# Altium project tafiti-obc.PrjPcb
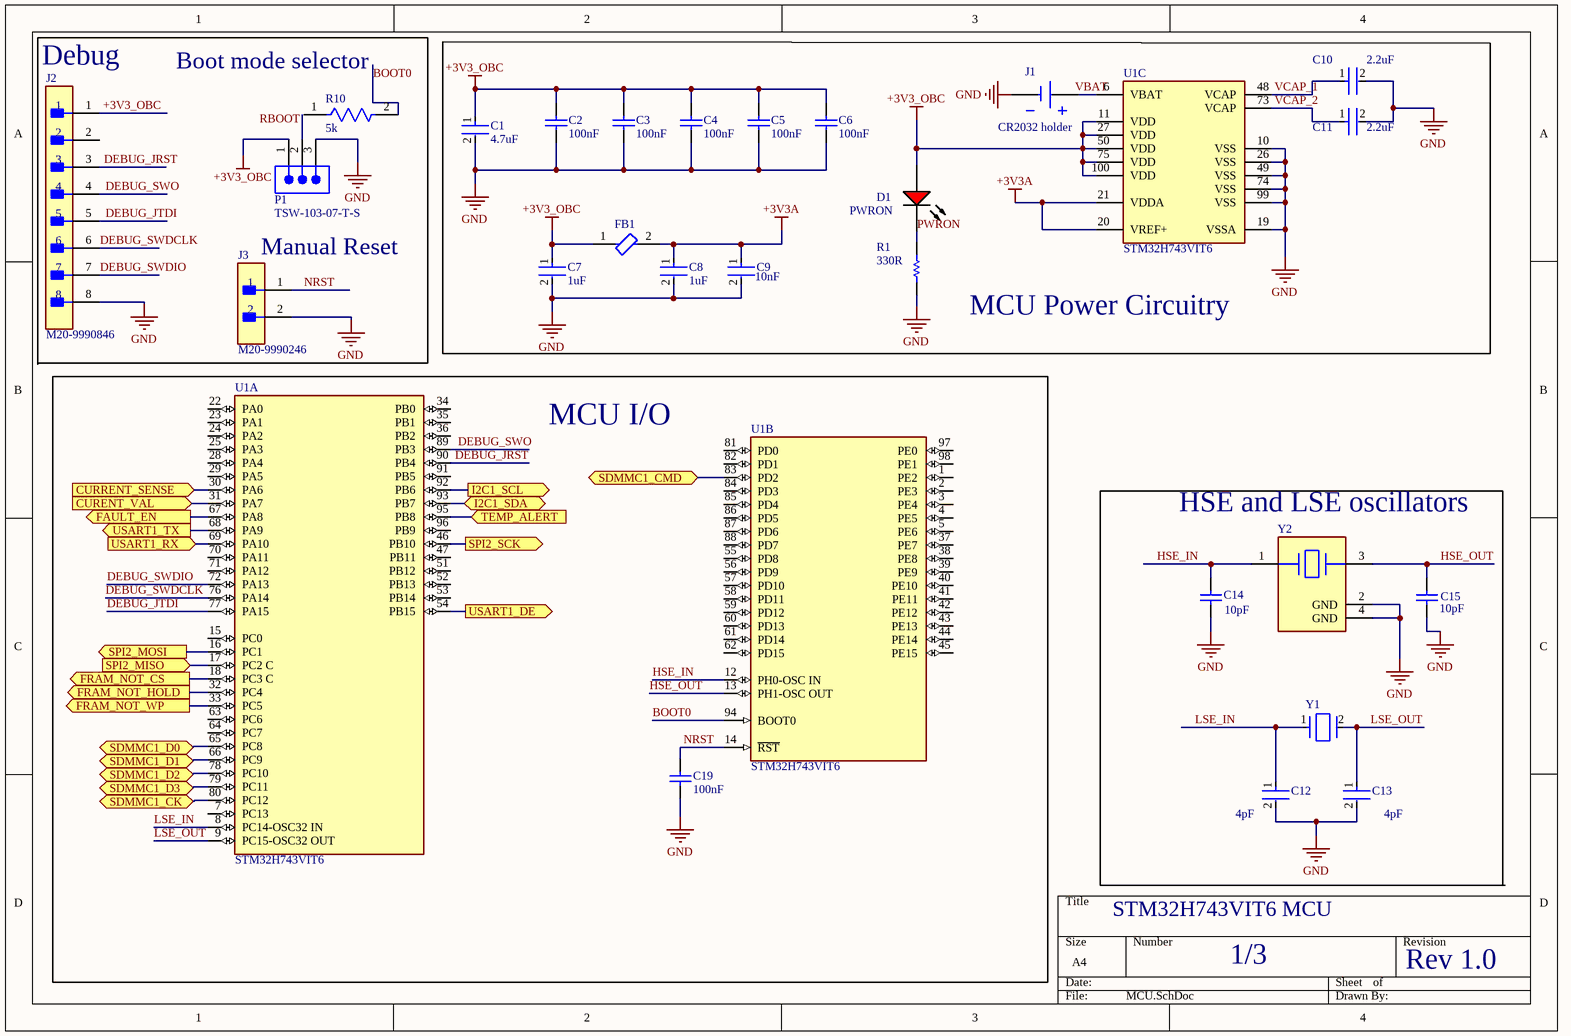
[diagram p0: MCU.SchDoc]
3 sheets, 57 parts. Net scope: flat (ports and power ports of the same name join across sheets).
Board file: tafiti-obc.PcbDoc
Sheets:
  MCU.SchDoc
  OTHER_PARTS.SchDoc
  CONNECTOR.SchDoc

## Sheet MCU.SchDoc
size A4; SheetNumber: 1; SheetTotal: 2

### Parts
C1  4.7uF  [FP-0805-L_2_0_0_1-W_1_25-IPC_B]
C2  100nF  [SAMS-C0603-2_M]
C3  100nF  [SAMS-C0603-2_M]
C4  100nF  [SAMS-C0603-2_M]
C5  100nF  [SAMS-C0603-2_M]
C6  100nF  [SAMS-C0603-2_M]
C7  1uF  [FP-CL10-IPC_C]
C8  1uF  [FP-CL10-IPC_C]
C9  10nF  [FP-CC0402-MFG]
C10  2.2uF  [FP-CC0805-0_85-MFG]
C11  2.2uF  [FP-CC0805-0_85-MFG]
C12  4pF  [FP-GRM033-0_03-IPC_B]
C13  4pF  [FP-GRM033-0_03-IPC_B]
C14  10pF  [CAPC1005X55X25ML05T05]
C15  10pF  [CAPC1005X55X25ML05T05]
C19  100nF  [SAMS-C0603-2_M]
D1  PWRON  [EVRL-0603-2_V]
FB1  MMZ1005D121CTD25  [FP-MMZ1005-IPC_C]  (value not drawn)
J1  CR2032 holder  [KEYSTONE-1025-7-2_V]
J2  M20-9990846  [FP-M20-9990846-MFG]
J3  M20-9990246  [FP-M20-9990246-MFG]
P1  TSW-103-07-T-S  [SMTC-TSW-103-07-X-S]
R1  330R  [RESC1608X55X25NL10T15]
R10  5k  [FP-MCR01-MFG]
U1  STM32H743VIT6  [FP-LQFP100-1L-MFG]  (parts A,B,C of 3)
Y1  ABS06-107-32.768KHZ-T  [FP-ABS06-MFG]  (value not drawn)
Y2  ABM3B-25.000MHZ-10-1-U-T  [FP-ABM3B-MFG]  (value not drawn)

### Blocks framed on the sheet
Debug: J2 J3 P1 R10
MCU Power Circuitry: C1-C11 D1 FB1 J1 R1 U1
MCU I/O: C19 U1
HSE and LSE oscillators: C12-C15 Y1 Y2

### Ports
CURENT_VAL (in), CURRENT_SENSE (in), FAULT_EN (out), FRAM_NOT_CS (out), FRAM_NOT_HOLD (out), FRAM_NOT_WP (out), I2C1_SCL (out), I2C1_SDA (bidir), SDMMC1_CK (bidir), SDMMC1_CMD (bidir), SDMMC1_D0 (bidir), SDMMC1_D1 (bidir), SDMMC1_D2 (bidir), SDMMC1_D3 (bidir), SPI2_MISO (in), SPI2_MOSI (out), SPI2_SCK (out), TEMP_ALERT (in), USART1_DE (out), USART1_RX (in), USART1_TX (out)

### Nets
+3V3_OBC: C1.1 C2.2 C3.2 C4.2 C5.2 C6.2 C7.1 D1.1(A) FB1.1 J2.1 P1.1 U1.11(VDD) U1.27(VDD) U1.50(VDD) U1.75(VDD) U1.100(VDD)
+3V3A: C8.1 C9.1 FB1.2 U1.20(VREF+) U1.21(VDDA)
GND: C1.2 C2.1 C3.1 C4.1 C5.1 C6.1 C7.2 C8.2 C9.2 C10.2 C11.2 C12.2 C13.2 C14.1 C15.1 C19.1 J1.2(-) J2.8 J3.2 P1.3 R1.1 U1.10(VSS) U1.19(VSSA) U1.26(VSS) U1.49(VSS) U1.74(VSS) U1.99(VSS) Y2.2(GND) Y2.4(GND)
BOOT0: R10.2 U1.94(BOOT0)
CURENT_VAL: U1.31(PA7) ; port CURENT_VAL
CURRENT_SENSE: U1.30(PA6) ; port CURRENT_SENSE
DEBUG_JRST: J2.3 U1.90(PB4)
DEBUG_JTDI: J2.5 U1.77(PA15)
DEBUG_SWDCLK: J2.6 U1.76(PA14)
DEBUG_SWDIO: J2.7 U1.72(PA13)
DEBUG_SWO: J2.4 U1.89(PB3)
FAULT_EN: U1.67(PA8) ; port FAULT_EN
FRAM_NOT_CS: U1.18(PC3_C) ; port FRAM_NOT_CS
FRAM_NOT_HOLD: U1.32(PC4) ; port FRAM_NOT_HOLD
FRAM_NOT_WP: U1.33(PC5) ; port FRAM_NOT_WP
HSE_IN: C14.2 U1.12(PH0-OSC_IN) Y2.1
HSE_OUT: C15.2 U1.13(PH1-OSC_OUT) Y2.3
I2C1_SCL: U1.92(PB6) ; port I2C1_SCL
I2C1_SDA: U1.93(PB7) ; port I2C1_SDA
LSE_IN: C12.1 U1.8(PC14-OSC32_IN) Y1.1
LSE_OUT: C13.1 U1.9(PC15-OSC32_OUT) Y1.2
NRST: C19.2 J3.1 U1.14(~{RST})
PWRON: D1.2(K) R1.2
SDMMC1_CK: U1.80(PC12) ; port SDMMC1_CK
SDMMC1_CMD: U1.83(PD2) ; port SDMMC1_CMD
SDMMC1_D0: U1.65(PC8) ; port SDMMC1_D0
SDMMC1_D1: U1.66(PC9) ; port SDMMC1_D1
SDMMC1_D2: U1.78(PC10) ; port SDMMC1_D2
SDMMC1_D3: U1.79(PC11) ; port SDMMC1_D3
SPI2_MISO: U1.17(PC2_C) ; port SPI2_MISO
SPI2_MOSI: U1.16(PC1) ; port SPI2_MOSI
SPI2_SCK: U1.46(PB10) ; port SPI2_SCK
TEMP_ALERT: U1.95(PB8) ; port TEMP_ALERT
USART1_DE: U1.54(PB15) ; port USART1_DE
USART1_RX: U1.69(PA10) ; port USART1_RX
USART1_TX: U1.68(PA9) ; port USART1_TX
VCAP_1: C10.1 U1.48(VCAP)
VCAP_2: C11.1 U1.73(VCAP)
NetJ1_1: J1.1(+) U1.6(VBAT)

Not connected (* = marked no-connect by the designer): J2 2; P1 2; R10 1; U1 1(PE2) 2(PE3) 3(PE4) 4(PE5) 5(PE6) 7(PC13) 15(PC0) 22(PA0) 23(PA1) 24(PA2) 25(PA3) 28(PA4) 29(PA5) 34(PB0) 35(PB1) 36(PB2) 37(PE7) 38(PE8) 39(PE9) 40(PE10) 41(PE11) 42(PE12) 43(PE13) 44(PE14) 45(PE15) 47(PB11) 51(PB12) 52(PB13) 53(PB14) 55(PD8) 56(PD9) 57(PD10) 58(PD11) 59(PD12) 60(PD13) 61(PD14) 62(PD15) 63(PC6) 64(PC7) 70(PA11) 71(PA12) 81(PD0) 82(PD1) 84(PD3) 85(PD4) 86(PD5) 87(PD6) 88(PD7) 91(PB5) 96(PB9) 97(PE0) 98(PE1)

### Notes on the sheet
- (near R10) Boot mode selector
- (near J3) Manual Reset
- STM32H743VIT6 MCU
- 1/3
- Rev 1.0
- Labels drawn without touching a wire or pin: RBOOT, VBAT

### Library data of the parts
C1 = CMP-14477-004784-2: Multilayer Ceramic Capacitor 4.7 uF 16V X7R 10% SMD 0805 T/R; Tolerance: 10%; Voltage Rating: 16V; Height: 1.25mm; Width: 0.049inch; Length: 2mm; Series: M; Case Code (Metric): 2012; Case Code (Imperial): 0805; Dielectric: X7R; Packaging: Tape and Reel; Case/Package: 0805; Capacitance: 4.7uF; Halogen Free: Halogen Free; RoHS Compliant: Yes; Package Quantity: 3000; Contact Plating: Tin; Max Operating Temperature: 125°C; Min Operating Temperature: -55°C; Resistor Type: Ceramic; Mount: Surface Mount; Voltage Rating (DC): 16V; Termination: SMD/SMT; Number of Pins: 2; Thickness: 0.053inch; Construction: Flat
C2-C6 C19 = CMP-2000-05332-1: Multi-layer Ceramic Capacitor, -55 to 125 degC, 2-Pin SMD (0603), RoHS, Tape and Reel; Manufacturer: Samsung Electro-Mechanics; Capacitance: 0.1µF; Rated Voltage: 50V; Dielectric: X7R; Tolerance (%): ±10%; Case Size/Dimension: 0603; Datasheet URL: https://datasheet.ciiva.com/29198/456651-da-01-en-vs-kondensator-0605-29198839.pdf; Manufacturer URL: http://www.samsungsem.com/global/index.jsp; Datasheet Version: Nov-10
C7 C8 = CMP-13271-004127-1: Cap Ceramic 1uF 25V X5R ±10% Pad SMD 0603 +85°C T/R; Height: 0.8mm; Capacitance: 1uF; Depth: 0.8mm; Package Quantity: 1; Mount: Surface Mount; Contact Plating: Tin; Voltage Rating: 25V; Dielectric: X5R; Packaging: Tape and Reel; Material: Ceramic; Case Code (Metric): 1608; Length: 1.6mm; Voltage: 25V; Min Operating Temperature: -55°C; Width: 0.031inch; Tolerance: 10%; Case/Package: 0603; Radiation Hardening: No; Case Code (Imperial): 0603; Thickness: 0.035inch; Lead Free: Lead Free; Max Operating Temperature: 85°C; Voltage Rating (DC): 25V
C9 = CMP-03422-000804-1: CAP CER 10000PF 10V X7R 0402; Manufacturer: YAGEO; Manufacturer Part Number: CC0402KRX7R6BB103; Automotive Grade: NA; Material: Ceramic; Tolerance: 0.1; Temperature Coefficient: 30ppm/°C; Temperature Characteristic: X7R; Digikey Description: CAP CER 10000PF 10V X7R 0402; Footprint Url: http://www.yageo.com/exep/pages/download/literatures/UPY-C_GEN_24.pdf; Category: Cap; RoHS: TRUE; Temperature Range Low: -55°C; Lead Free: Yes; ComponentLink2Description: Datasheet; Device Class L2: Capacitors; Temperature Range High: +125°C; Value: 10 nF; Ipc Land Pattern Name: CAPC10050X50; Temperature: -55°C to +125°C; ComponentLink2URL: http://www.yageo.com/documents/recent/UPY-GP_NP0_16V-to-50V_16.pdf; Device Class L3: Ceramic Capacitors; Capacitance: 10 nF; Package: CC0402; Height: 0.55mm; Automotive: No; Octopart: https://octopart.com/cc0402krx7r6bb103-yageo-26721868; Mouser Description: Multilayer Ceramic Capacitors MLCC - SMD/SMT 10nF 10V X7R 10%; Device Class L1: Passive Components; Voltage Rating: 10 V
C10 C11 = CMP-1036-04838-2: CAP CER 2.2UF 25V X7R 0805; Manufacturer Part Number: CC0805KKX7R8BB225; Manufacturer: Yageo; Material: Ceramic; Tolerance: 0.1; Device Class L1: Passive Components; Value: 2.2 uF; Temperature: -30°C to +85°C; Octopart: https://octopart.com/cc0805kkx7r8bb225-yageo-42522865; ComponentLink2Description: Datasheet; Capacitance: 2.2 uF; ComponentLink2URL: http://www.yageo.com/documents/recent/UPY-GPHC_Y5V_6.3V-to-50V_8.pdf; Mouser Description: Multilayer Ceramic Capacitors MLCC - SMD/SMT 2.2uF 25V X7R 10%; RoHS: TRUE; Temperature Range High: +85°C; Lead Free: Yes; Voltage Rating: 25 V; Height: 0.95mm; Category: Cap; Automotive: No; Digikey Description: CAP CER 2.2UF 25V X7R 0805; Temperature Characteristic: X7R; Ipc Land Pattern Name: CAPC200125X85; Device Class L2: Capacitors; Footprint Url: http://www.yageo.com/exep/pages/download/literatures/UPY-C_GEN_24.pdf; Package: CC0805-0.85; Device Class L3: Ceramic Capacitors; Temperature Range Low: -30°C
C12 C13 = CMP-2010-01389-2: Chip Multilayer Ceramic Capacitors for General Purpose, 0201, 4.0pF, C0G, 30ppm/°C, 0.25pF, 25V; Case Code (Imperial): 0201; Thickness: 0.013inch; Voltage Rating (DC): 25V; Termination: SMD/SMT; Dielectric: C0G; Length: 0.024inch; Height: 0.3mm; Width: 0.012inch; Min Operating Temperature: -55°C; Capacitance: 4pF; Case/Package: 0201; Voltage Rating: 25V; Case Code (Metric): 0603; Packaging: Tape and Reel; Max Operating Temperature: 125°C; Mount: Surface Mount; Package Quantity: 15000; Lead Free: Lead Free
C14 C15 = CMP-2100-03589-1: Chip Capacitor, 10 pF, +/- 5%, 50 V, -55 to 125 degC, 0402 (1005 Metric), RoHS, Tape and Reel; Manufacturer: Yageo; Insulation Resistance: 100GR; Voltage Rating (DC): 50V; Dielectric Material: Ceramic; Temperature Coefficient: 30ppm/degC; Dielectric: C0G; Termination: SMD/SMT; Package Reference: 0402; Lead Free: LeadFree; Composition: Ceramic; Tolerance: 5%; Case Code (Metric): 1005; Voltage Rating: 50V; Packaging: TapeandReel; Manufacturer URL: http://www.yageo.com/; REACH SVHC: NoSVHC; Max Operating Temperature: 125degC; Length: 1mm; Mount: SurfaceMount; Depth: 0.5mm; Min Operating Temperature: -55degC; Number of Pins: 2; Width: 0.02inch; Datasheet Version: Rev. 14, 07/2016; Package Quantity: 1; Datasheet URL: http://www.yageo.com/documents/recent/UPY-GP_NP0_16V-to-50V_14.pdf; Case Code (Imperial): 0402; RoHSCompliant: True; Radiation Hardening: No; Height: 0.5mm; Case/Package: 0402; Thickness: 0.022inch; Capacitance: 10pF; Package Description: 2-Pin Surface Mount Device, Body 1 x 0.5 mm; Voltage: 50V
D1 = CMP-2100-03578-1: Chip LED, Red, 5 V, 25 mA, -40 to 85 degC, 2-Pin SMD (0603), RoHS, Tape and Reel; Manufacturer: Everlight Electronics; Forward Voltage: 2.2V; Lens Style: Clear; Package Reference: 0603; Case/Package: 0603; RoHSCompliant: false; Package Description: 2-Pin Surface Mount Device, Body 1.6 x 0.8 mm; Colour: Red; Lead Free: LeadFree; Datasheet URL: https://datasheet.ciiva.com/4688/el-19-217-r6c-al1m2vy-3tpdf-187026-4688713.pdf; Manufacturer URL: http://www.everlight.com/; Datasheet Version: Rev. 1, 01/2005
FB1 = CMP-08257-000320-1: Signal Line Ferrite Bead 120Ω @ 100MHz 350mA DCR 600mΩ AEC-Q200 SMD 0402; DC Resistance-Max: 600mR; Impedance: 120R; Number of Lines: 1; Max Current Rating: 350mA; Mount: Surface Mount; Case Code (Imperial): 0402; Case Code (Metric): 1005; Lead Free: Lead Free; Series: MMZ; Min Operating Temperature: -55°C; DC Resistance (DCR): 600mR; Height: 0.022inch; Case/Package: 0402; Current Rating: 350mA; Ratings: AEC-Q200; Packaging: Tape and Reel; Max Operating Temperature: 125°C; RoHS Compliant: Yes; Length: 0.039inch; Width: 0.02inch; Package Quantity: 10000
J1 = CMP-0465-00001-2: Holder for 2477 or 2430 Cells P/N 1025-7, Body 27.762 x 30.963 mm, THM; Manufacturer: Keystone; # of Cells: 1; Cell Size: 24 mm; ComponentLink1Description: Manufacturer URL; PackageDescription: 2-Pin Hand Drawn, Body 27.762 x 30.963 mm; Material: Plastic; ComponentLink1URL: http://www.keyelco.com/; Type: HOLDER; ComponentLink2URL: http://www.keyelco.com/product-pdf.cfm?p=3950; Switch Current Limit (Typ) (A): 1; PartNumber: 1025-7; ComponentLink2Description: Datasheet; PackageReference: KEYSTONE-1025-7-2; DatasheetVersion: Rev.C; Mounting Technology: Through Hole
J2 = CMP-15831-000033-1: CONN HEADER VERT 8POS 2.54MM; Connector Type: Male Pin; Gender: Male; Insulation Resistance: 1GR; Number of Positions: 8; Contact Resistance: 30mR; Current Rating: 3A; Termination: Solder; Case/Package: SIL; RoHS Compliant: Yes; Series: M20; Housing Material: Nylon; Radiation Hardening: No; Package Quantity: 1000; Contact Material: Brass; Contact Plating: Tin; Max Operating Temperature: 105°C; Contact Mating Length: 0.24inch; Depth: 2.54mm; Color: Black; Number of Contacts: 8; Mount: Through Hole; Number of Rows: 1; Packaging: Bulk; Min Operating Temperature: -40°C; Max Current Rating: 3A; REACH SVHC: No SVHC; Pitch: 2.54mm; Housing Color: Black; Orientation: Straight; Length: 20.32mm; Contact Type: Male Pin
J3 = CMP-15831-000009-1: CONN HEADER VERT 2POS 2.54MM; Manufacturer: Harwin; Conn Gender: Male; Conn Orientation: Vertical; Number Of Contacts: 2; Current Rating: 3A; ComponentLink2URL: https://cdn.harwin.com/pdfs/M20-999.pdf; ComponentLink2Description: Datasheet; Package: M20-9990246; Temperature: -40°C to +105°C; Octopart: https://octopart.com/m20-9990246-harwin-2590635; Mouser Description: 2.54mm (0.1") Pitch SIL Vertical PC Tail Pin Header, 6.1mm mating pin height, tin, 2 contacts; Temperature Range High: +105°C; Device Class L1: Connectors; RoHS: TRUE; Automotive: No; Height: 8.99mm; Number Of Rows: 1; Contact Material: Tin,Nickel; Category: Conn; Pitch: 2.54mm; Lead Free: Yes; Digikey Description: CONN HEADER VERT 2POS 2.54MM; Manufacturer Part Number: M20-9990246; Temperature Range Low: -40°C; Device Class L3: unset; Device Class L2: Headers and Wire Housings
P1 = CMP-1024-00332-1: 0.025" SQ Post Header, Through-hole, Vertical, -55 to 105 degC, 2.54 mm Pitch, 3-Pin, Male, RoHS; Manufacturer: Samtec; Pitch: 2.54 mm; ComponentLink1URL: http://www.samtec.com; ComponentLink3URL: http://www.samtec.com/documents/webfiles/cpdf/TSW-XXX-XX-XXX-X-XX-XXX-MKT.pdf; PartNumber: TSW-103-07-T-S; Mounting Technology: Through-hole; RoHS: True; DatasheetVersion: F-214; PackageVersion: DM, 8/1988; Temperature Range: -55 to 105 degC; ComponentLink2Description: Datasheet; ComponentLink1Description: Manufacturer URL; Orientation: Vertical; PackageReference: TSW-103-07-X-S; ComponentLink3Description: Package Specification; ComponentLink2URL: http://www.samtec.com/documents/webfiles/pdf/TSW_TH.PDF; PackageDescription: .025[0.64] SQ. Post Terminal Strip Assembly
R1 = CMP-1659-00020-2: Chip Resistor, 330 Ohm, +/- 1%, 0.1 W, -55 to 155 degC, 0603 (1608 Metric), RoHS, Tape and Reel; Tolerance: 10%; ESR: 800 mohm; Voltage Rating (DC): 16 V; Capacitance: 47 uF; Length: 7.3 mm; ComponentLink1URL: http://www.yageo.com/; Packaging: Tape and Reel; Pins: 2; ComponentLink1Description: Manufacturer URL; Case Code (Imperial): 2917; REACH SVHC: No SVHC; Width: 4.3 mm; ComponentLink2Description: Datasheet; Voltage Rating: 16 V; RoHSCompliant: True; Max Operating Temperature: 125degC; ComponentLink2URL: http://www.yageo.com/documents/recent/PYu-RC_Group_51_RoHS_L_04.pdf; Min Operating Temperature: -55degC; Case/Package: 2917; Radiation Hardening: No; DatasheetVersion: Rev. 4, 02/2016; Mount: Surface Mount; PackageReference: 0603; Package Quantity: 500; Case Code (Metric): 7343; PackageDescription: 2-Pin Surface Mount Device, Body 1.6 x 0.8 mm; Height: 3.1 mm
R10 = CMP-08839-006175-1: Thick Film Chip Resistor, 0402, 5.1kΩ, 1%, 100ppm/°C, 0.063W, 50V; Max Power Dissipation: 63mW; Resistance: 5.1kR; Temperature Coefficient: 400ppm/°C; Package Quantity: 10000; Length: 0.039inch; Number of Terminations: 2; Depth: 0.5mm; Case Code (Metric): 1005; Resistor Type: Thick Film; Series: MCR01; Width: 0.02inch; Construction: Rectangular; Case Code (Imperial): 0402; Case/Package: 0402; Voltage Rating (DC): 50V; Lead Free: Lead Free; RoHS Compliant: Yes; Packaging: Tape and Reel; Military Standard: Not; Height: 0.016inch; Max Operating Temperature: 155°C; Min Operating Temperature: -55°C; Tolerance: 1%; Features: Automotive AEC-Q200
U1 = CMP-12105-000050-1: IC MCU 32BIT 2MB FLASH 100LQFP; Manufacturer: STMicroelectronics; Number Of Ethernet Channels: 1; Number Of Usb Channels: 2; Number Of A/D Converters: 3; Min Supply Voltage: 1.71V; Ram Size: 1060KBytes; Number Of I2C Channels: 4; Frequency: 480MHz; Number Of Adc Channels: 36; Number Of I/Os: 82; Max Supply Voltage: 3.6V; Number Of Spi Channels: 6; Memory Size: 2MBytes; Max Junction Temp: +125°C; Core Architecture: Arm Cortex-M7; Interface: I2C,SPI,UART,USART,USB,LIN,IrDA,Ethernet,I2S,Other; Number Of Timers/Counters: 20; Data Bus Width: 32bits; Number Of Pwm Channels: 42; Number Of Uart Channels: 9; Standoff Height: 0.05mm; Device Class L1: Integrated Circuits (ICs); ComponentLink2URL: https://www.st.com/resource/en/datasheet/stm32h743vi.pdf; Automotive: No; Memory Type: FLASH; Number Of Cores: 1; Temperature Range Low: -40°C; RoHS: TRUE; Ambient Temperature Range Low: -40°C; ComponentLink2Description: Datasheet; Device Class L2: Embedded Processors and Controllers; Device Class L3: Microcontrollers; Digikey Description: IC MCU 32BIT 2MB FLASH 100LQFP; Temperature Range High: +125°C; Ambient Temperature Range High: +85°C; Package: LQFP100-1L; Temperature: -40°C to +125°C; Category: IC; Ipc Land Pattern Name: QFP50P1600X1600X160-100; Height: 1.6mm; Manufacturer Part Number: STM32H743VIT6; Octopart: https://octopart.com/stm32h743vit6-stmicroelectronics-76372527; Lead Free: Yes
Y1 = CMP-2000-05734-2: CRYSTAL 32.7680KHZ 4PF SMD; Frequency Tolerance: 20ppm; Series Resistance: 80kR; ESR (Equivalent Series Resistance): 60kR; Frequency Stability: 175ppm; Height: 0.024inch; Termination: SMD/SMT; Package Quantity: 3000; Frequency: 32.768kHz; RoHS Compliant: Yes; Max Operating Temperature: 85°C; Length: 0.079inch; Radiation Hardening: No; Case/Package: 0805; Tolerance: 20ppm; REACH SVHC: No SVHC; Case Code (Imperial): 0805; Width: 0.047inch; Min Operating Temperature: -40°C; Case Code (Metric): 2012; Load Capacitance: 4pF; Mount: Surface Mount; Packaging: Tape and Reel; Lead Free: Lead Free; Number of Pins: 2
Y2 = CMP-27762-002145-1: Crystal 25MHz ±10ppm 10pF SMD-4 5mm x 3.2mm; ESR (Equivalent Series Resistance): 50R; Package Quantity: 1000; Min Operating Temperature: -10°C; Resistor Type: Ceramic; Series: ABM3B; Packaging: Tape and Reel; Case/Package: CSMD; Length: 5mm; Mount: Surface Mount; Tolerance: 10ppm; Height: 0.043inch; Width: 3.2mm; Load Capacitance: 10pF; Frequency: 25MHz; Lead Free: Lead Free; Radiation Hardening: No; Max Operating Temperature: 60°C; Termination: SMD/SMT; Frequency Stability: 10ppm; Number of Pins: 4; RoHS Compliant: Yes; Operating Frequency: 25 MHz; Frequency Tolerance: 10ppm; Depth: 3.2mm; REACH SVHC: No SVHC

## Sheet OTHER_PARTS.SchDoc
size A4; SheetNumber: 2; SheetTotal: 2
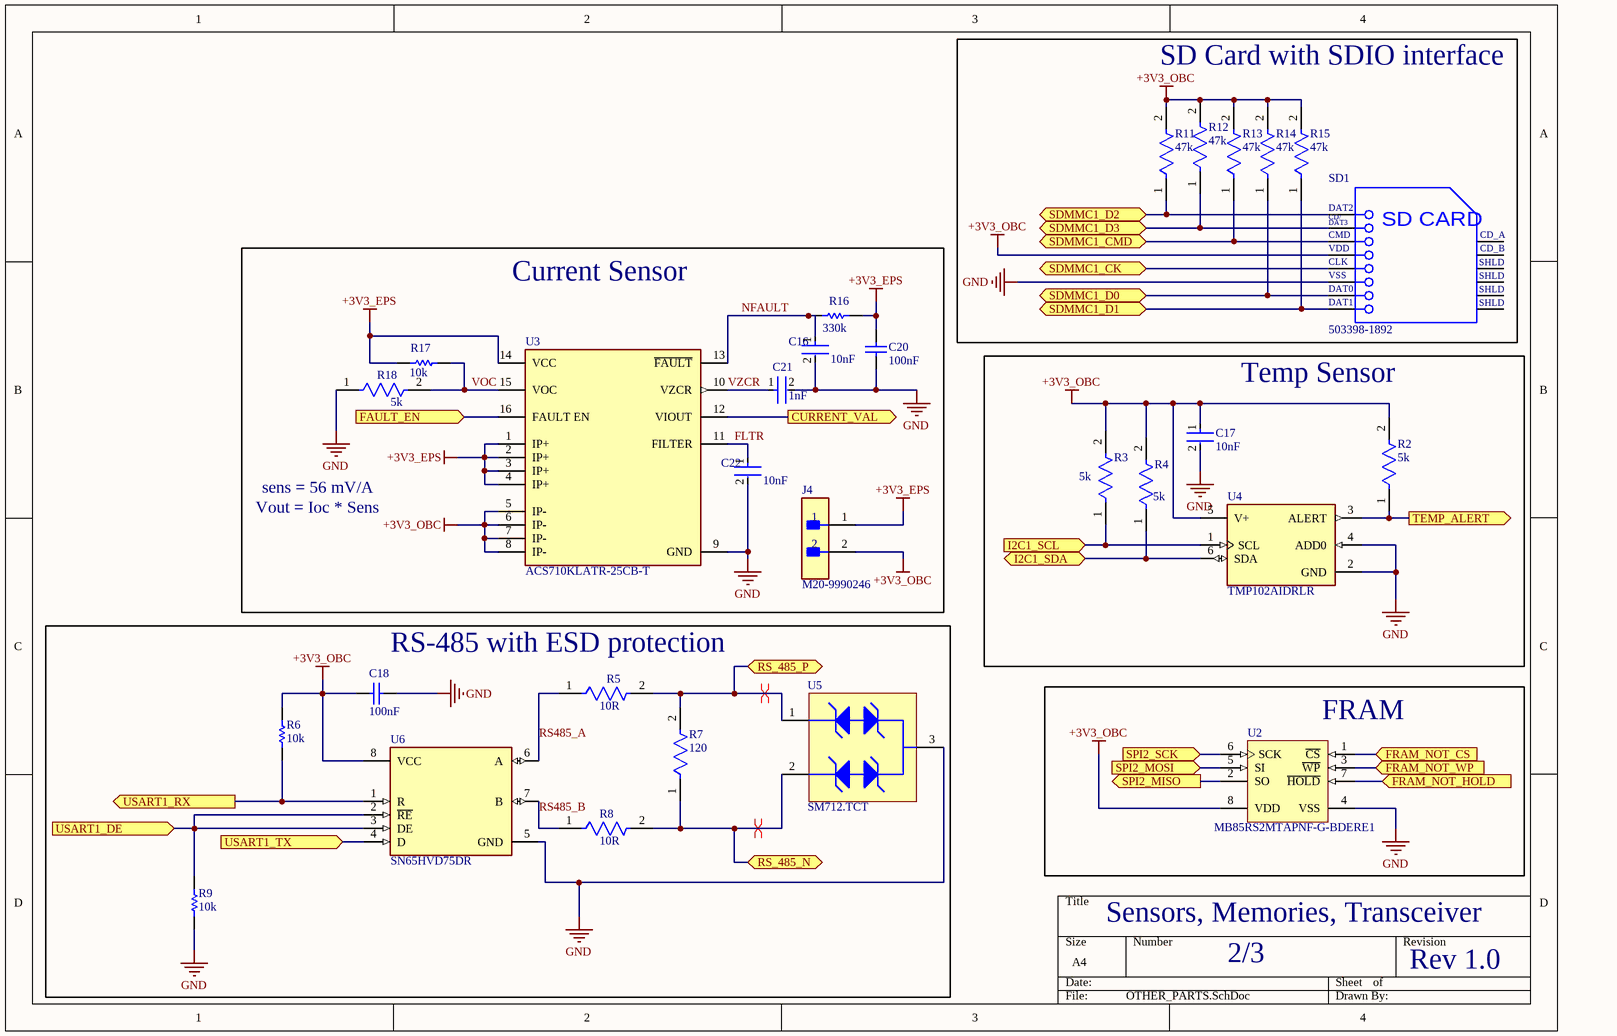
[diagram p1: OTHER_PARTS.SchDoc]

### Parts
C16  10nF  [FP-CL165-IPC_C]
C17  10nF  [FP-CL165-IPC_C]
C18  100nF  [SAMS-C0603-2_M]
C20  100nF  [SAMS-C0603-2_M]
C21  1nF  [FP-CC0402-MFG]
C22  10nF  [FP-CL165-IPC_C]
J4  M20-9990246  [FP-M20-9990246-MFG]
R2  5k  [FP-MCR01-MFG]
R3  5k  [FP-MCR01-MFG]
R4  5k  [FP-MCR01-MFG]
R5  10R  [FP-SR0805-MFG]
R6  10k  [RESC1608X55X25ML10T15]
R7  120  [FP-AC1206-MFG]
R8  10R  [FP-SR0805-MFG]
R9  10k  [RESC1608X55X25ML10T15]
R11  47k  [FP-MCR01-IPC_C]
R12  47k  [FP-MCR01-IPC_C]
R13  47k  [FP-MCR01-IPC_C]
R14  47k  [FP-MCR01-IPC_C]
R15  47k  [FP-MCR01-IPC_C]
R16  330k  [RESC1005X40X25ML05T10]
R17  10k  [RESC1608X55X25ML10T15]
R18  5k  [FP-MCR01-MFG]
SD1  503398-1892  [MOLX-503398-1892_V]
U2  MB85RS2MTAPNF-G-BDERE1  [CYP-S08.15_M]
U3  ACS710KLATR-25CB-T  [FP-LA-16-IPC_C]
U4  TMP102AIDRLR  [FP-DRL0006A-MFG]
U5  SM712.TCT  [SMTC-SOT23-3_V]
U6  SN65HVD75DR  [FP-D0008A-MFG]

### Blocks framed on the sheet
SD Card with SDIO interface: R11-R15 SD1
Current Sensor: C16 C20-C22 J4 R16-R18 U3
Temp Sensor: C17 R2-R4 U4
RS-485 with ESD protection: C18 R5-R9 U5 U6
FRAM: U2

### Ports
CURRENT_VAL (out), FAULT_EN (in), FRAM_NOT_CS (in), FRAM_NOT_HOLD (in), FRAM_NOT_WP (in), I2C1_SCL (in), I2C1_SDA (bidir), RS_485_N (bidir), RS_485_P (bidir), SDMMC1_CK (bidir), SDMMC1_CMD (bidir), SDMMC1_D0 (bidir), SDMMC1_D1 (bidir), SDMMC1_D2 (bidir), SDMMC1_D3 (bidir), SPI2_MISO (out), SPI2_MOSI (in), SPI2_SCK (in), TEMP_ALERT (out), USART1_DE (in), USART1_RX (out), USART1_TX (in)

### Nets
+3V3_EPS: C20.2 J4.1 R16.2 R17.2 U3.1(IP+) U3.2(IP+) U3.3(IP+) U3.4(IP+) U3.14(VCC)
+3V3_OBC: C17.1 C18.1 J4.2 R2.2 R3.2 R4.2 R6.2 R11.2 R12.2 R13.2 R14.2 R15.2 SD1.4(VDD) U2.8(VDD) U3.5(IP-) U3.6(IP-) U3.7(IP-) U3.8(IP-) U4.5(V+) U6.8(VCC)
GND: C16.2 C17.2 C18.2 C20.1 C21.2 C22.2 R9.1 R18.1 SD1.6(VSS) U2.4(VSS) U3.9(GND) U4.2(GND) U4.4(ADD0) U5.3 U6.5(GND)
CURRENT_VAL: U3.12(VIOUT) ; port CURRENT_VAL
FAULT_EN: U3.16(FAULT_EN) ; port FAULT_EN
FLTR: C22.1 U3.11(FILTER)
FRAM_NOT_CS: U2.1(~{CS}) ; port FRAM_NOT_CS
FRAM_NOT_HOLD: U2.7(~{HOLD}) ; port FRAM_NOT_HOLD
FRAM_NOT_WP: U2.3(~{WP}) ; port FRAM_NOT_WP
I2C1_SCL: R3.1 U4.1(SCL) ; port I2C1_SCL
I2C1_SDA: R4.1 U4.6(SDA) ; port I2C1_SDA
NFAULT: C16.1 R16.1 U3.13(~{FAULT})
RS485_A: R5.1 U6.6(A)
RS485_B: R8.1 U6.7(B)
RS_485_N: R7.1 R8.2 U5.2 ; port RS_485_N
RS_485_P: R5.2 R7.2 U5.1 ; port RS_485_P
SDMMC1_CK: SD1.5(CLK) ; port SDMMC1_CK
SDMMC1_CMD: R13.1 SD1.3(CMD) ; port SDMMC1_CMD
SDMMC1_D0: R14.1 SD1.7(DAT0) ; port SDMMC1_D0
SDMMC1_D1: R15.1 SD1.8(DAT1) ; port SDMMC1_D1
SDMMC1_D2: R11.1 SD1.1(DAT2) ; port SDMMC1_D2
SDMMC1_D3: R12.1 SD1.2(CD/DAT3) ; port SDMMC1_D3
SPI2_MISO: U2.2(SO) ; port SPI2_MISO
SPI2_MOSI: U2.5(SI) ; port SPI2_MOSI
SPI2_SCK: U2.6(SCK) ; port SPI2_SCK
TEMP_ALERT: R2.1 U4.3(ALERT) ; port TEMP_ALERT
USART1_DE: R9.2 U6.2(~{RE}) U6.3(DE) ; port USART1_DE
USART1_RX: R6.1 U6.1(R) ; port USART1_RX
USART1_TX: U6.4(D) ; port USART1_TX
VOC: R17.1 R18.2 U3.15(VOC)
VZCR: C21.1 U3.10(VZCR)

Not connected (* = marked no-connect by the designer): SD1 9(CD_A) 10(CD_B) 11(SHLD) 12(SHLD) 13(SHLD) 14(SHLD)

### Layout directives
differential pair: RS_485_N, RS_485_P

### Notes on the sheet
- Vout = Ioc * Sens
- sens = 56 mV/A
- Sensors, Memories, Transceiver
- 2/3
- Rev 1.0
- (in symbol CMP-2000-05621-1) CD/; DAT3; SD CARD

### Library data of the parts
C16 C17 C22 = CMP-13271-000387-1: Cap Ceramic 10nF 50V X7R ±10% SMD 0402 +125°C Paper T/R; Depth: 0.5mm; Length: 1mm; Lead Free: Lead Free; Case Code (Metric): 1005; Width: 0.02inch; Min Operating Temperature: -55°C; Thickness: 0.022inch; Package Quantity: 1; Mount: Surface Mount; Height: 0.5mm; Voltage: 50V; Material: Ceramic; Tolerance: 10%; Case Code (Imperial): 0402; Radiation Hardening: No; Case/Package: 0402; Max Operating Temperature: 125°C; Voltage Rating (DC): 50V; Contact Plating: Tin; Packaging: Tape and Reel; Voltage Rating: 50V; Capacitance: 10nF; Dielectric: X7R
C18 C20 = CMP-2000-05332-1: as C2 on sheet MCU; Case Size/Dimension: 0603; Datasheet URL: https://datasheet.ciiva.com/29198/456651-da-01-en-vs-kondensator-0605-29198839.pdf; Manufacturer URL: http://www.samsungsem.com/global/index.jsp; Datasheet Version: Nov-10
C21 = CMP-2002-03059-2: CAP CER 1000PF 50V X7R 0402; Manufacturer: YAGEO; Manufacturer Part Number: CC0402KRX7R9BB102; Value: 1.0 nF; Automotive Grade: NA; Tolerance: 0.1; Material: Ceramic; Temperature Coefficient: 30ppm/°C; Temperature Range High: +125°C; Device Class L3: Ceramic Capacitors; ComponentLink2Description: Datasheet; Footprint Url: http://www.yageo.com/exep/pages/download/literatures/UPY-C_GEN_24.pdf; ComponentLink2URL: http://www.yageo.com/documents/recent/UPY-GP_NP0_16V-to-50V_16.pdf; Mouser Description: 0402 1000 pF 50 V ±10 % Tolerance X7R SMT Multilayer Ceramic Capacitor; Ipc Land Pattern Name: CAPC10050X50; Temperature Range Low: -55°C; Digikey Description: CAP CER 1000PF 50V X7R 0402; Temperature Characteristic: X7R; Voltage Rating: 50 V; Lead Free: Yes; Device Class L1: Passive Components; Height: 0.55mm; Capacitance: 1.0 nF; Category: Cap; Device Class L2: Capacitors; Temperature: -55°C to +125°C; Package: CC0402; Octopart: https://octopart.com/cc0402krx7r9bb102-yageo-192889; Automotive: No; RoHS: TRUE
J4 = CMP-15831-000009-1: as J3 on sheet MCU; ComponentLink2URL: https://cdn.harwin.com/pdfs/M20-999.pdf; ComponentLink2Description: Datasheet; Package: M20-9990246; Temperature: -40°C to +105°C; Octopart: https://octopart.com/m20-9990246-harwin-2590635; Mouser Description: 2.54mm (0.1") Pitch SIL Vertical PC Tail Pin Header, 6.1mm mating pin height, tin, 2 contacts; Temperature Range High: +105°C; Device Class L1: Connectors; RoHS: TRUE; Automotive: No; Height: 8.99mm; Number Of Rows: 1; Contact Material: Tin,Nickel; Category: Conn; Pitch: 2.54mm; Lead Free: Yes; Digikey Description: CONN HEADER VERT 2POS 2.54MM; Manufacturer Part Number: M20-9990246; Temperature Range Low: -40°C; Device Class L3: unset; Device Class L2: Headers and Wire Housings
R2-R4 R18 = CMP-08839-006175-1: as R10 on sheet MCU; Package Quantity: 10000; Length: 0.039inch; Number of Terminations: 2; Depth: 0.5mm; Case Code (Metric): 1005; Resistor Type: Thick Film; Series: MCR01; Width: 0.02inch; Construction: Rectangular; Case Code (Imperial): 0402; Case/Package: 0402; Voltage Rating (DC): 50V; Lead Free: Lead Free; RoHS Compliant: Yes; Packaging: Tape and Reel; Military Standard: Not; Height: 0.016inch; Max Operating Temperature: 155°C; Min Operating Temperature: -55°C; Tolerance: 1%; Features: Automotive AEC-Q200
R5 R8 = CMP-03412-003758-1: RES 10 OHM 1% 1/2W 0805; Manufacturer Part Number: SR0805FR-4710RL; Manufacturer: Yageo; Power Rating: 0.5W; Tolerance: 0.01; Value: 10Ω; Automotive Grade: Grade 0; Voltage Rating: 150V; ComponentLink2Description: Datasheet; RoHS: TRUE; Device Class L1: Passive Components; Footprint Url: http://www.yageo.com/exep/pages/download/literatures/PYu-R_Mount_10.pdf; Height: 0.6mm; Digikey Description: RES 10 OHM 1% 1/2W 0805; Temperature Range Low: -55°C; Mouser Description: Res Surge Chip Thick Film 0805 10 Ohm 1% 1/2W ±200ppm/°C Molded Paper T/R; Temperature Range High: +155°C; Octopart: https://octopart.com/sr0805fr-4710rl-yageo-91478096; Composition: Thick Film; Temperature: -55°C to +155°C; Ipc Land Pattern Name: RESC200125X50; Package: SR0805; Device Class L3: Chip SMD Resistors; Device Class L2: Resistors; Series: SR; ComponentLink2URL: http://www.yageo.com/documents/recent/PYu-SR_D_F%20tol_RoHS_L_3.pdf; Lead Free: Yes; Automotive: Yes; Category: Res; Resistance: 10Ω
R6 R9 R17 = CMP-2000-05022-1: Resistor, 10 KOhm, +/- 5%, 100 mW, -55 to 155 degC, 0603 (1608 Metric), RoHS, Tape and Reel; Manufacturer: Yageo; Resistance: 10kOhms; Voltage Rating: 50V; Temperature Coefficient: 100PPM/C; Power Rating: 100mW; Package Reference: 603; Series: RC; Case Code - mm: 1608; Packaging: Reel; Datasheet URL: http://www.farnell.com/datasheets/443971.pdf; Datasheet Version: Rev. 4, 04/2009; Operating Temperature Range: -55Cto+155C; Product: ThickFilmResistorsGeneralPurpose; Package Description: 2-Pin Surface Mount Device, Body 1.6 x 0.8 mm; Manufacturer URL: http://www.yageo.com/; Case Code - in: 0603; Tolerance: 5%; Termination Style: SMD/SMT
R7 = CMP-03412-006306-1: RES SMD 120 OHM 1% 1/4W 1206; Manufacturer: Yageo; Manufacturer Part Number: AC1206FR-07120RL; Value: 120Ω; Automotive Grade: Grade 0; Voltage Rating: 200V; Power Rating: 0.25W; Tolerance: 0.01; Lead Free: Yes; Ipc Land Pattern Name: RESC310160X55; Resistance: 120Ω; RoHS: TRUE; Digikey Description: RES SMD 120 OHM 1% 1/4W 1206; Footprint Url: http://www.yageo.com/exep/pages/download/literatures/PYu-R_Mount_10.pdf; Temperature: -55°C to +155°C; Octopart: https://octopart.com/ac1206fr-07120rl-yageo-30511031; Device Class L3: Chip SMD Resistors; ComponentLink2Description: Datasheet; Device Class L1: Passive Components; Temperature Range High: +155°C; Category: Res; Temperature Range Low: -55°C; Automotive: Yes; Series: AC; Package: AC1206; ComponentLink2URL: http://www.yageo.com/NewPortal/yageodocoutput?fileName=/pdf/R-Chip/PYu-AC_51_RoHS_L_6.pdf; Mouser Description: Thick Film Resistors - SMD 1/4W 120ohm 1% AEC-Q200; Composition: Thick Film; Height: 0.65mm; Device Class L2: Resistors
R11-R15 = CMP-08839-009136-1: Thick Film Chip Resistor, 0402, 47kΩ, 1%, 100ppm/°C, 0.063W, 50V; Resistance: 47kR; Temperature Coefficient: 400ppm/°C; Power Rating: 63mW; Depth: 0.5mm; Construction: Rectangular; Width: 0.02inch; Package Quantity: 1; Length: 0.039inch; Tolerance: 1%; Number of Terminations: 2; Case Code (Imperial): 0402; Packaging: Tape and Reel; Min Operating Temperature: -55°C; Mount: Surface Mount; RoHS Compliant: Yes; Max Operating Temperature: 155°C; Series: MCR01; Voltage Rating (DC): 50V; Size Code: 0402; Lead Free: Lead Free; Resistor Type: Thick Film; Case/Package: 0402; Features: Automotive AEC-Q200; Case Code (Metric): 1005; Military Standard: Not; Max Power Dissipation: 63mW; Height: 0.016inch
R16 = CMP-2002-07612-1: Manufacturer: Yageo / Phycomp; Part Number: RC0402FR-07330KL
SD1 = CMP-2000-05621-1: Micro SD Connector, Pitch 1.1 mm, 8 Position, Height 1.4 mm, -25 to 85 degC, RoHS, Tape and Reel; Manufacturer: Molex; Voltage Rating: 10VAC/DC; Current Rating: 500mA; Manufacturer URL: http://www.molex.com/; Package Reference: 503398-1892; Packaging: Reel; RoHS: Details; Brand: Molex; Datasheet URL: http://www.molex.com/pdm_docs/sd/5033981892_sd.pdf; Mounting Technology: SurfaceMount; Factory Pack Quantity: 2400; Datasheet Version: Rev. E, 04/2006; Series: 503398; Product Category: MemoryCardConnectors; Package Description: Micro SD Connector, Pitch 1.1 mm, 8 Position, Height 1.4 mm
U2 = CMP-1640-00001-1: 1-Mbit Serial F-RAM, 2 to 3.6 V, -40 to 85 degC, 8-Pin SOIC (S08.15), RoHS, Tube; Generic Part Number: FM25V10; PartNumber: FM25V10-G; Supply Voltage Min: 2 V; Memory Size: 1 Mbits; Access Time: 18 ns; Supply Voltage Max: 3.6 V; Temperature Min: -40 degC; Temperature Max: 85 degC; ComponentLink3Description: Package Specification; Code_JEDEC: MS-012; ComponentLink1Description: Manufacturer URL; RoHS: TRUE; ComponentLink3URL: http://www.mill-max.com/assets/pdfs/metric/007M.PDF; ComponentLink1URL: http://www.cypress.com/; PackageDescription: 8-Pin SOIC, Body 4.9 x 3.9 mm, Pitch 1.27 mm; ComponentLink2URL: http://www.cypress.com/file/41691/download; PackageVersion: Rev. *D, 12/2009; ComponentLink2Description: Datasheet; Mounting Technology: Surface Mount; Packing: Tube; DatasheetVersion: Rev. *F
U3 = CMP-82923-000225-1: SENSOR CURRENT HALL 25A AC/DC; Accuracy: 2.9%; Linearity: 0.75%; Max Supply Current: 14.5mA; Frequency: 120kHz; Sensitivity: 28mV/A; Max Supply Voltage: 5.5V; Polarity: Bidirectional; Min Supply Voltage: 3V; Quiescent Current: 11mA; Output Type: Analog; Response Time: 4us; Number of Channels: 1; Case/Package: SOIC; Mount: Surface Mount; Number of Pins: 16; Current Sensing: 25A; Packaging: Cut Tape; Series: -; RoHS Compliant: Yes; Bandwidth: 120kHz; REACH SVHC: No SVHC; Package Quantity: 1; Max Operating Temperature: 125°C; Min Operating Temperature: -40°C
U4 = CMP-04948-000029-1: SENSOR DIGITAL -40C-125C SOT563; Number of Bits: 12; Output Current: 3mA; Max Supply Voltage: 3.6V; Min Supply Voltage: 1.4V; Nominal Supply Current: 85uA; Operating Supply Current: 1uA; Resolution: 12b; Interface: I2C; Quiescent Current: 10uA; Lead Free: Lead Free; RoHS Compliant: Yes; Package Quantity: 4000; Weight: 9.9E-05oz; Series: -; Output Type: Digital; Radiation Hardening: No; Max Operating Temperature: 125°C; Case/Package: SOT-563; REACH SVHC: No SVHC; Number of Pins: 6; Supply Current: 85uA; Max Supply Voltage (DC): 3.6V; Min Supply Voltage (DC): 1.4V; Mount: Surface Mount; Min Operating Temperature: -40°C; Packaging: Tape and Reel
U5 = CMP-2000-05357-1: Asymmetrical TVS Diode for Extended Common-Mode RS-485, 400 W, -55 to 125 degC, 3-Pin SOT23, RoHS, Tape and Reel; Manufacturer: Semtech; Configuration: Dual; Peak Pulse Power Dissipation: 400W; Product Length (mm): 2.9mm; Working Voltage: 12V/7V; Product Height (mm): 0.95mm; Direction Type: Bi-Directional; Product Depth (mm): 1.3mm; Reverse Breakdown Voltage: 13.3V; Reverse Stand-off Voltage: 12V; Leakage Current (Max): 0.02uA; Number of Elements: 2; Peak Pulse Current: 17A; Leakage Current: 1uA/20uA; Rad Hardened: No; Test Current (It): 1mA; Clamping Voltage: 26V/12V; Datasheet URL: https://datasheet.ciiva.com/18065/getdatasheetpartid-110620-18065348.pdf; Operating Temperature Classification: Military; Operating Temperature Min Deg. C: -55C; Manufacturer URL: http://www.semtech.com/; Package Reference: SOT23-3; Operating Temp Range: -55Cto125C; Mounting Style: SurfaceMount; Polarity: Bi-Directional; Pin Count: 3; Package Description: 3-Pin Small Outline Transistor, Body 2.9 x 1.3 mm, Pitch 0.95 mm; Datasheet Version: Nov-04; Mounting: SurfaceMount; Suppressor Type: TVS; Packaging: TapeandReel; Package / Case: SOT-23; Operating Temperature Max Deg. C: 125C
U6 = CMP-0694-00003-3: IC TRANSCEIVER HALF 1/1 8SOIC; Max Supply Voltage: 3.6V; Number of Receivers: 1; Data Rate: 20Mbps; Operating Supply Voltage: 3.3V; Simplex/Duplex: Half Duplex; Receiver Hysteresis: 80mV; Interface: RS-422; Supply Current: 950uA; Min Supply Voltage: 3V; Lead Free: Lead Free; Max Operating Temperature: 125°C; Min Operating Temperature: -40°C; Packaging: Tape and Reel; REACH SVHC: No SVHC; Number of Transmitters: 1; Logic Function: Transceiver; Radiation Hardening: No; RoHS Compliant: Yes; Number of Drivers: 1; Contact Plating: Gold; Series: -; Number of Transceivers: 1; Case/Package: D; Package Quantity: 2500; Number of Pins: 8; Nominal Supply Current: 950uA

## Sheet CONNECTOR.SchDoc
size A4; SheetNumber: 3; SheetTotal: 3
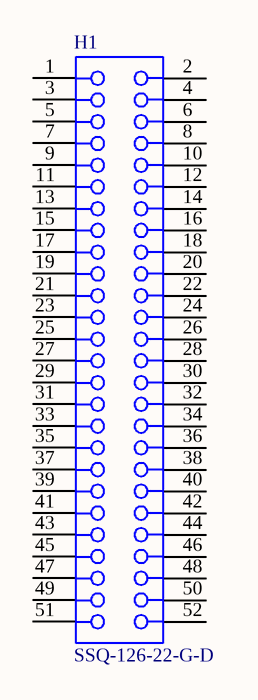
[diagram p2: CONNECTOR.SchDoc]

### Parts
H1  SSQ-126-22-G-D  [SMTC-SSQ-126-22-X-D]

### Nets

Not connected (* = marked no-connect by the designer): H1 1 2 3 4 5 6 7 8 9 10 11 12 13 14 15 16 17 18 19 20 21 22 23 24 25 26 27 28 29 30 31 32 33 34 35 36 37 38 39 40 41 42 43 44 45 46 47 48 49 50 51 52

### Library data of the parts
H1 = CMP-1023-00317-1: SQ Post Socket, Through-hole, Vertical, -55 to 125 degC, 2.54 mm Pitch, 52-Pin, Female, RoHS; Manufacturer: Samtec; Pitch: 2.54 mm; ComponentLink1Description: Manufacturer URL; ComponentLink3Description: Package Specification; PackageVersion: BD, 6/1987; ComponentLink2URL: http://www.samtec.com/documents/webfiles/pdf/SSQ_TH.PDF; Temperature Range: -55 to 125 degC; PackageDescription: Assembly, Socket Strip .025[0.64] SQ Tail; Mounting Technology: Through-hole; ComponentLink3URL: http://www.samtec.com/documents/webfiles/cpdf/SSQ-1XX-XX-XXX-X-XX-XXX-XX-X-MKT.pdf; PartNumber: SSQ-126-22-G-D; ComponentLink2Description: Datasheet; ComponentLink1URL: http://www.samtec.com; DatasheetVersion: F-214; RoHS: True; Orientation: Vertical; PackageReference: SSQ-126-22-X-D

## Nets that join several sheets
+3V3_OBC: MCU (16 pins), OTHER_PARTS (20 pins)
GND: MCU (29 pins), OTHER_PARTS (15 pins)
FAULT_EN: MCU (U1.67), OTHER_PARTS (U3.16)
FRAM_NOT_CS: MCU (U1.18), OTHER_PARTS (U2.1)
FRAM_NOT_HOLD: MCU (U1.32), OTHER_PARTS (U2.7)
FRAM_NOT_WP: MCU (U1.33), OTHER_PARTS (U2.3)
I2C1_SCL: MCU (U1.92), OTHER_PARTS (R3.1 U4.1)
I2C1_SDA: MCU (U1.93), OTHER_PARTS (R4.1 U4.6)
SDMMC1_CK: MCU (U1.80), OTHER_PARTS (SD1.5)
SDMMC1_CMD: MCU (U1.83), OTHER_PARTS (R13.1 SD1.3)
SDMMC1_D0: MCU (U1.65), OTHER_PARTS (R14.1 SD1.7)
SDMMC1_D1: MCU (U1.66), OTHER_PARTS (R15.1 SD1.8)
SDMMC1_D2: MCU (U1.78), OTHER_PARTS (R11.1 SD1.1)
SDMMC1_D3: MCU (U1.79), OTHER_PARTS (R12.1 SD1.2)
SPI2_MISO: MCU (U1.17), OTHER_PARTS (U2.2)
SPI2_MOSI: MCU (U1.16), OTHER_PARTS (U2.5)
SPI2_SCK: MCU (U1.46), OTHER_PARTS (U2.6)
TEMP_ALERT: MCU (U1.95), OTHER_PARTS (R2.1 U4.3)
USART1_DE: MCU (U1.54), OTHER_PARTS (R9.2 U6.2 U6.3)
USART1_RX: MCU (U1.69), OTHER_PARTS (R6.1 U6.1)
USART1_TX: MCU (U1.68), OTHER_PARTS (U6.4)